# EAGLE design hubi2c-n32 (EAGLE 7.7.0)
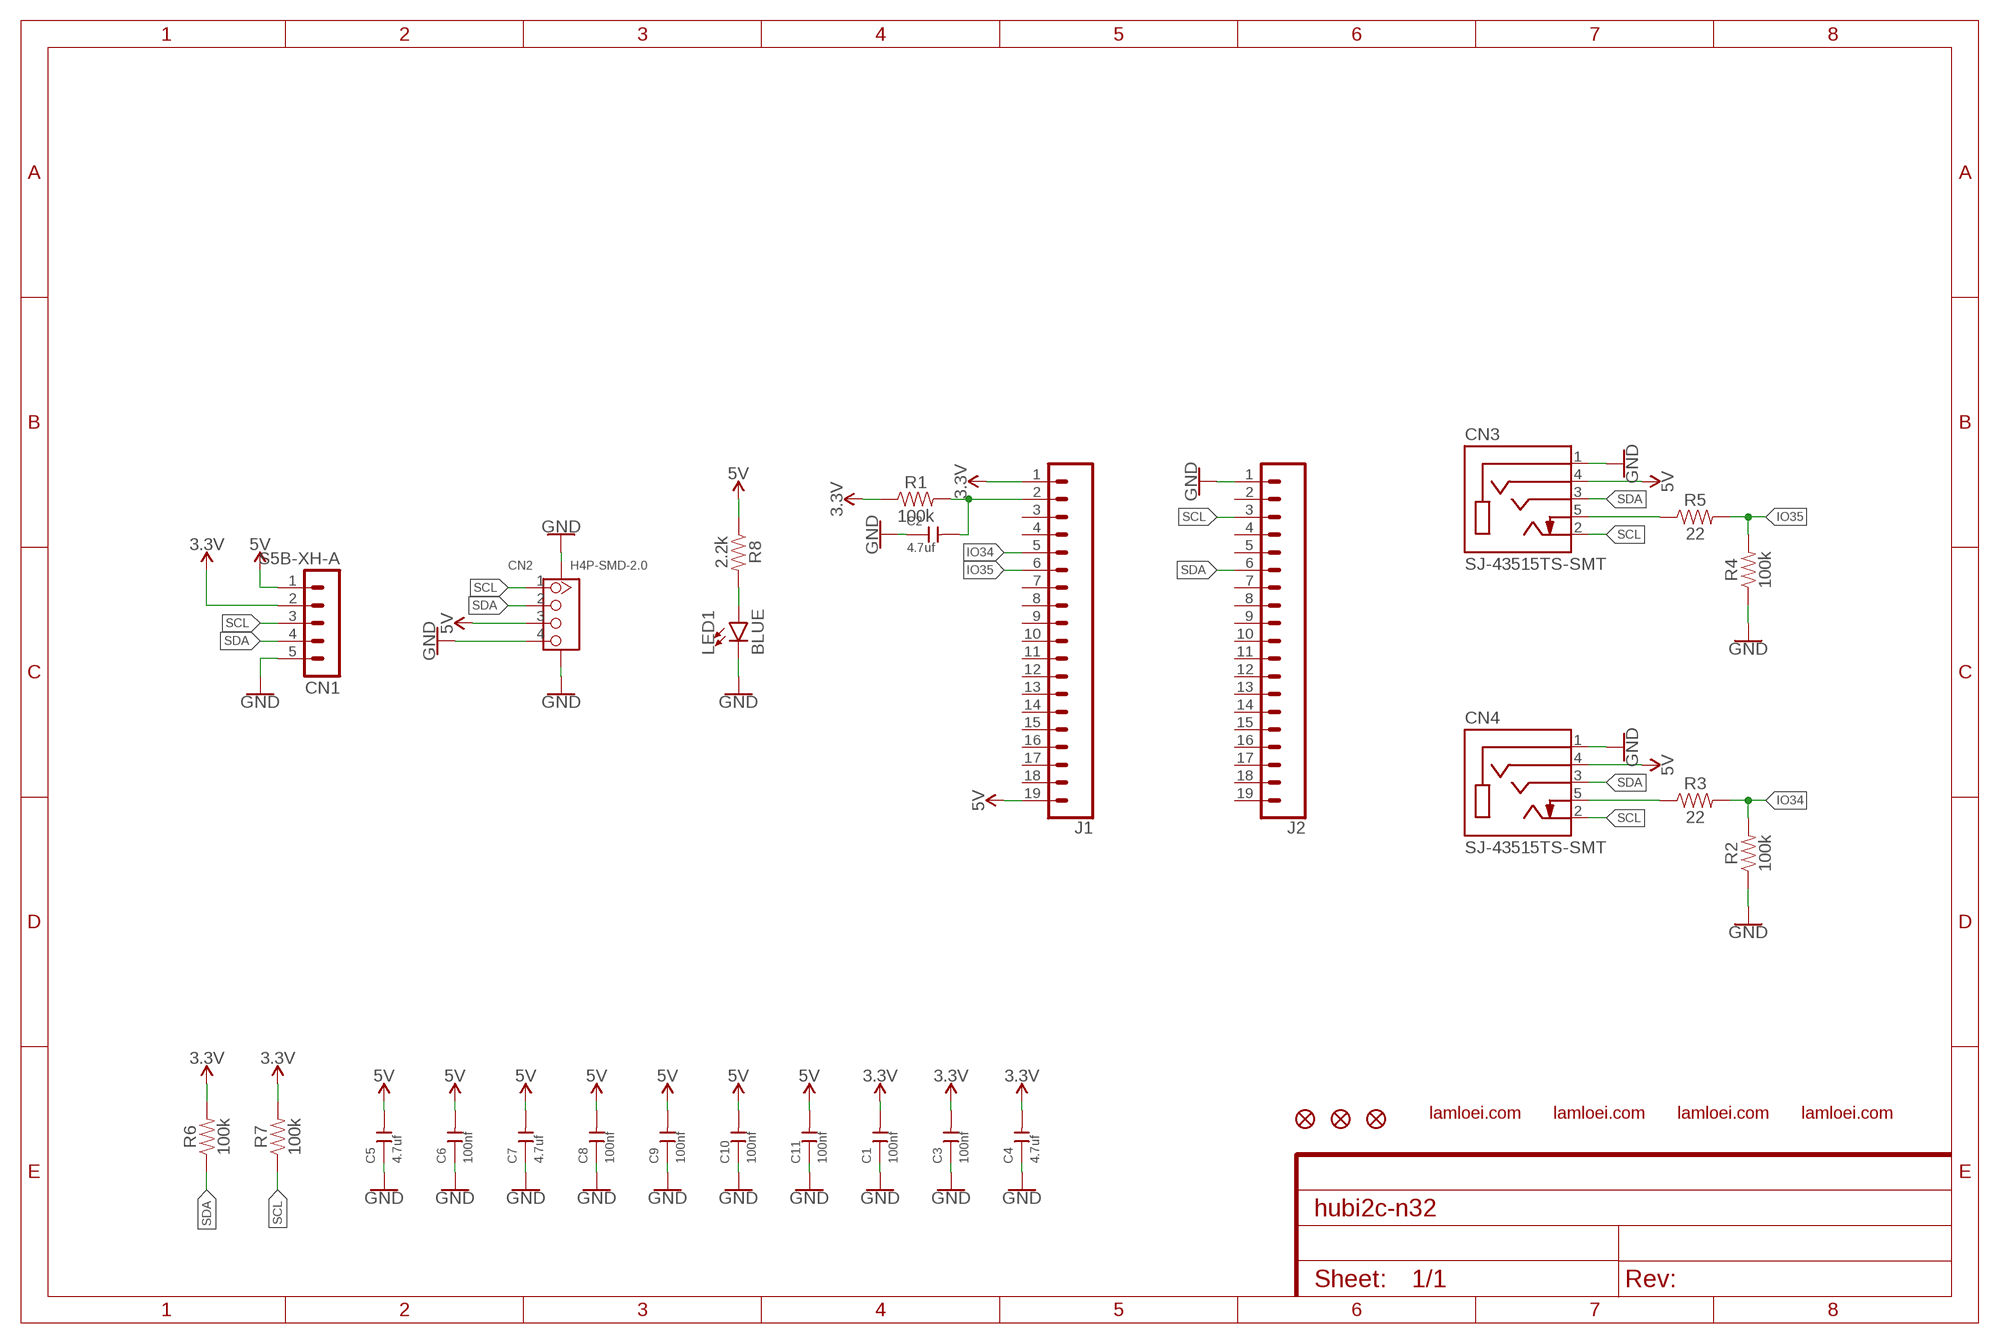
[diagram p0: schematic, sheet 1]

## Parts
C1  100nf  CERAMIC-100NF-25V-10%-X7R(0402)  [C0402]
C2  4.7uf  CERAMIC-4.7UF-10V-10%-X5R(0603)  [C0603]
C3  100nf  CERAMIC-100NF-25V-10%-X7R(0402)  [C0402]
C4  4.7uf  CERAMIC-4.7UF-10V-10%-X5R(0603)  [C0603]
C5  4.7uf  CERAMIC-4.7UF-10V-10%-X5R(0603)  [C0603]
C6  100nf  CERAMIC-100NF-25V-10%-X7R(0402)  [C0402]
C7  4.7uf  CERAMIC-4.7UF-10V-10%-X5R(0603)  [C0603]
C8  100nf  CERAMIC-100NF-25V-10%-X7R(0402)  [C0402]
C9  100nf  CERAMIC-100NF-25V-10%-X7R(0402)  [C0402]
C10  100nf  CERAMIC-100NF-25V-10%-X7R(0402)  [C0402]
C11  100nf  CERAMIC-100NF-25V-10%-X7R(0402)  [C0402]
CN1  S5B-XH-A  [S5B-XH-A]
CN2  H4P-SMD-2.0  GROVE-CONNECTOR-SMD(4+2P-2.0)  [HW4-SMD-2.0]
CN3  SJ-43515TS-SMT  [CUI_SJ-43515TS-SMT]
CN4  SJ-43515TS-SMT  [CUI_SJ-43515TS-SMT]
J1  CONN_19  [1X19]
J2  CONN_19  [1X19]
LED1  BLUE  LED-BLUE0603  [LED-0603]
R1  100k  100KOHM-0603-1/10W-1%  [0603]
R2  100k  100KOHM-0603-1/10W-1%  [0603]
R3  22  0OHM-0603-1/10W  [0603]
R4  100k  100KOHM-0603-1/10W-1%  [0603]
R5  22  0OHM-0603-1/10W  [0603]
R6  100k  100KOHM-0603-1/10W-1%  [0603]
R7  100k  100KOHM-0603-1/10W-1%  [0603]
R8  2.2k  2.2KOHM-0603-1/10W-1%  [0603]
ZFD1  FIDUCIAL1X2  [FIDUCIAL-1X2]
ZFD2  FIDUCIAL1X2  [FIDUCIAL-1X2]
ZFD3  FIDUCIAL1X2  [FIDUCIAL-1X2]
ZL1  LAMLEOI_LOGO_3  [LAMLEOI_LOGO_3]
ZL2  LAMLEOI_LOGO_3  [LAMLEOI_LOGO_3]
ZL3  LAMLEOI_LOGO_3  [LAMLEOI_LOGO_3]
ZL4  LAMLOEI_BIGLOGO  [LAMLOEI_BIGLOGO]

## Nets
3.3V: C1.2 C3.2 C4.2 CN1.2 J1.1 R1.1 R6.2 R7.2
5V: C5.2 C6.2 C7.2 C8.2 C9.2 C10.2 C11.2 CN1.1 CN2.3 CN3.4(RING2) CN4.4(RING2) J1.19 R8.1
GND: C1.1 C2.1 C3.1 C4.1 C5.1 C6.1 C7.1 C8.1 C9.1 C10.1 C11.1 CN1.5 CN2.4 CN2.SS1 CN2.SS2 CN3.1(SLEEVE) CN4.1(SLEEVE) J2.1 LED1.C R2.1 R4.1
IO34: J1.5 R2.2 R3.2
IO35: J1.6 R4.2 R5.2
N$1: CN4.5(TIP_SWITCH) R3.1
N$2: CN3.5(TIP_SWITCH) R5.1
N$3: C2.2 J1.2 R1.2
N$4: LED1.A R8.2
SCL: CN1.3 CN2.1 CN3.2(TIP) CN4.2(TIP) J2.3 R7.1
SDA: CN1.4 CN2.2 CN3.3(RING1) CN4.3(RING1) J2.6 R6.1
Unconnected: J1.3 J1.4 J1.7 J1.8 J1.9 J1.10 J1.11 J1.12 J1.13 J1.14 J1.15 J1.16 J1.17 J1.18 J2.2 J2.4 J2.5 J2.7 J2.8 J2.9 J2.10 J2.11 J2.12 J2.13 J2.14 J2.15 J2.16 J2.17 J2.18 J2.19

## Library data of the parts
C1 C3 C6 C8-C11 = Capacitor-2016:CERAMIC-100NF-25V-10%-X7R(0402): 302010024; MPN: CC0402KRX7R8BB104
C2 C4 C5 C7 = Capacitor-2016:CERAMIC-4.7UF-10V-10%-X5R(0603): 302010111; MPN: CC0603KRX5R6BB475
CN1 = con-JST XH:S5B-XH: JST XH series header 2.50mm pitch disconnectable crimp style connectors, horizontal (side entry type), 5 pins
CN2 = Seeed-OPL-Connector:GROVE-CONNECTOR-SMD(4+2P-2.0): 320110030
CN3 CN4 = SJ-43515TS-SMT:SJ-43515TS-SMT: 4 conductor 3.5 mm Surface Mount Audio Jack w/ Tip Switch; AVAILABILITY: Unavailable; CUI_PURCHASE_URL: https://www.cuidevices.com/product/interconnect/connectors/audio-connectors/jacks/sj-4351x-smt-series?utm_source=snapeda.com&utm_medium=referral&utm_campaign=snapedaBOM; DESCRIPTION: 3.5 mm, 4 Conductors, Right Angle, Surface Mount _SMT_, Audio Jack Connector; MF: CUI Devices; MP: SJ-43515TS-SMT-TR; PACKAGE: None; PRICE: None
J1 = SparkFun-Connectors-2:CONN_19: Multi connection point. Often used as Generic Header-pin footprint for 0.1 inch spaced/style header connections On any of the 0.1 inch spaced packages, you can populate with these: Break Away Headers - Straight <https://www.sparkfun.com/products/116> (PRT-00116) Break Away Male Headers - Right Angle <https://www.sparkfun.com/products/553> (PRT-00553) Female Headers <https://www.sparkfun.com/products/115> (PRT-00115) Break Away Headers - Machine Pin <https://www.sparkfun.com/products/117> (PRT-00117) Break Away Female Headers - Swiss Machine Pin <https://www.sparkfun.com/products/743> (PRT-00743) For SCREWTERMINALS and SPRING TERMINALS visit here: Screw Terimnals on SparkFun.com <https://www.sparkfun.com/search/results?term=Screw+Terminals> (5mm/3.5mm/2.54mm spacing) This device is also useful as a general connection point to wire up your design to another part of your project. Our various solder wires solder well into these plated through hole pads. Hook-Up Wire - Assortment (Stranded, 22 AWG) <https://www.sparkfun.com/products/11375> (PRT-11375) Hook-Up Wire - Assortment (Solid Core, 22 AWG) <https://www.sparkfun.com/products/11367> (PRT-11367) View the entire wire category on our website here <https://www.sparkfun.com/categories/141> Special notes: Molex polarized connector foot print use with SKU : PRT-08231 with associated crimp pins and housings. 1MM SMD Version SKU: PRT-10208 NOTES ON THE VARIANTS LOCK and LOCK_LONGPADS... This footprint was designed to help hold the alignment of a through-hole component (i.e. 6-pin header) while soldering it into place. You may notice that each hole has been shifted either up or down by 0.005 of an inch from it's more standard position (which is a perfectly straight line). This slight alteration caused the pins (the squares in the middle) to touch the edges of the holes. Because they are alternating, it causes a "brace" to hold the component in place. 0.005 has proven to be the perfect amount of "off-center" position when using our standard breakaway headers. Although looks a little odd when you look at the bare footprint, once you have a header in there, the alteration is very hard to notice. Also,if you push a header all the way into place, it is covered up entirely on the bottom side.
J2 = SparkFun-Connectors-3:CONN_19: Multi connection point. Often used as Generic Header-pin footprint for 0.1 inch spaced/style header connections On any of the 0.1 inch spaced packages, you can populate with these: Break Away Headers - Straight <https://www.sparkfun.com/products/116> (PRT-00116) Break Away Male Headers - Right Angle <https://www.sparkfun.com/products/553> (PRT-00553) Female Headers <https://www.sparkfun.com/products/115> (PRT-00115) Break Away Headers - Machine Pin <https://www.sparkfun.com/products/117> (PRT-00117) Break Away Female Headers - Swiss Machine Pin <https://www.sparkfun.com/products/743> (PRT-00743) For SCREWTERMINALS and SPRING TERMINALS visit here: Screw Terimnals on SparkFun.com <https://www.sparkfun.com/search/results?term=Screw+Terminals> (5mm/3.5mm/2.54mm spacing) This device is also useful as a general connection point to wire up your design to another part of your project. Our various solder wires solder well into these plated through hole pads. Hook-Up Wire - Assortment (Stranded, 22 AWG) <https://www.sparkfun.com/products/11375> (PRT-11375) Hook-Up Wire - Assortment (Solid Core, 22 AWG) <https://www.sparkfun.com/products/11367> (PRT-11367) View the entire wire category on our website here <https://www.sparkfun.com/categories/141> Special notes: Molex polarized connector foot print use with SKU : PRT-08231 with associated crimp pins and housings. 1MM SMD Version SKU: PRT-10208 NOTES ON THE VARIANTS LOCK and LOCK_LONGPADS... This footprint was designed to help hold the alignment of a through-hole component (i.e. 6-pin header) while soldering it into place. You may notice that each hole has been shifted either up or down by 0.005 of an inch from it's more standard position (which is a perfectly straight line). This slight alteration caused the pins (the squares in the middle) to touch the edges of the holes. Because they are alternating, it causes a "brace" to hold the component in place. 0.005 has proven to be the perfect amount of "off-center" position when using our standard breakaway headers. Although looks a little odd when you look at the bare footprint, once you have a header in there, the alteration is very hard to notice. Also,if you push a header all the way into place, it is covered up entirely on the bottom side.
LED1 = SparkFun-LED:LED-BLUE: Blue SMD LED Used in manufacturing of various products at SparkFun Packages: 0603 - SMD 0603 package [Product Link] <http://www.digikey.com/product-detail/en/SMLE12BC7TT86/511-1589-2-ND/1641808> 1206 - SMD1206 package [Product Link] <http://www.digikey.com/product-detail/en/lite-on-inc/LTST-C150TBKT/160-1643-1-ND/573584> SparkFun Products: ESP8266 Thing-Dev Board <https://www.sparkfun.com/products/13711> RedBoard <https://www.sparkfun.com/products/12757>; PROD_ID: DIO-08575
R1 R2 R4 R6 R7 = SparkFun-Resistors:100KOHM: 100kΩ resistor A resistor is a passive two-terminal electrical component that implements electrical resistance as a circuit element. Resistors act to reduce current flow, and, at the same time, act to lower voltage levels within circuits. - Wikipedia; PROD_ID: RES-07828
R3 R5 = SparkFun-Resistors:0OHM: 0Ω resistor A resistor is a passive two-terminal electrical component that implements electrical resistance as a circuit element. Resistors act to reduce current flow, and, at the same time, act to lower voltage levels within circuits. - Wikipedia; PROD_ID: RES-08609; VALUE: 0
R8 = SparkFun-Resistors:2.2KOHM: 2.2kΩ resistor A resistor is a passive two-terminal electrical component that implements electrical resistance as a circuit element. Resistors act to reduce current flow, and, at the same time, act to lower voltage levels within circuits. - Wikipedia; PROD_ID: RES-08272
ZFD1-ZFD3 = SparkFun-Aesthetics:FIDUCIAL: Fiducial Alignment Points Point-of-reference for pick-and-place machines and other optical instruments.
ZL1-ZL3 = lamloei_logo_3:LAMLEOI_LOGO_3: lamloei
ZL4 = lamloei_logo_3:LAMLOEI_BIGLOGO

## Board
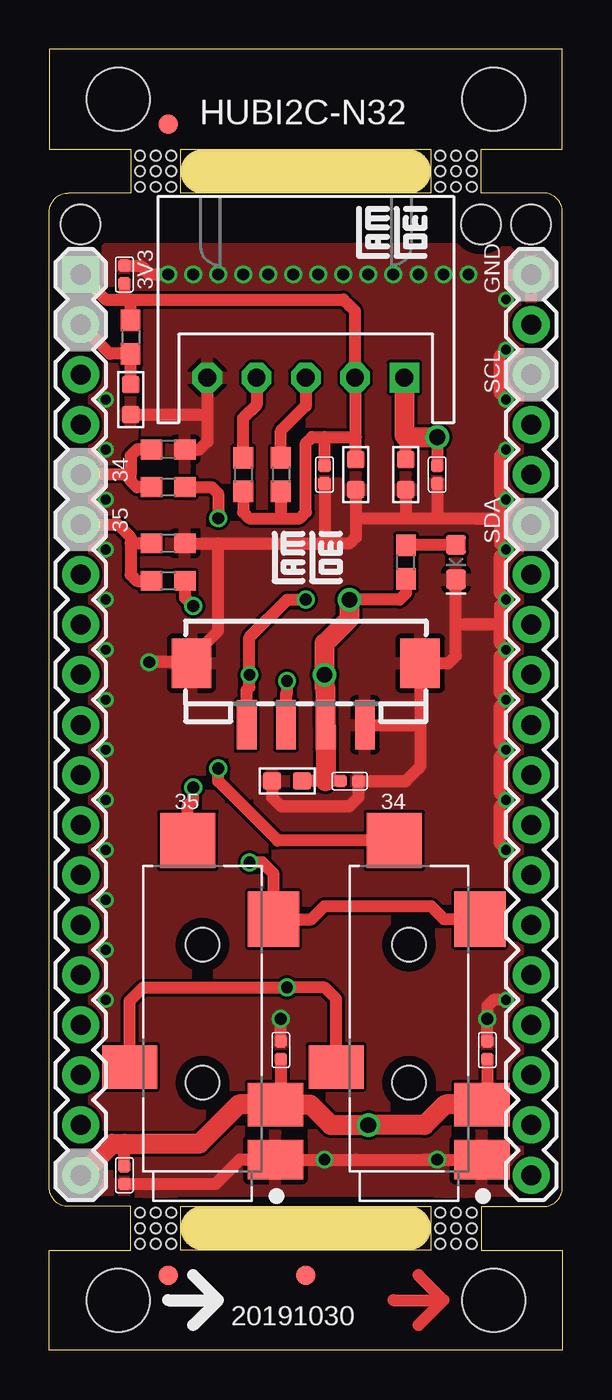
[diagram p1: board, top side]
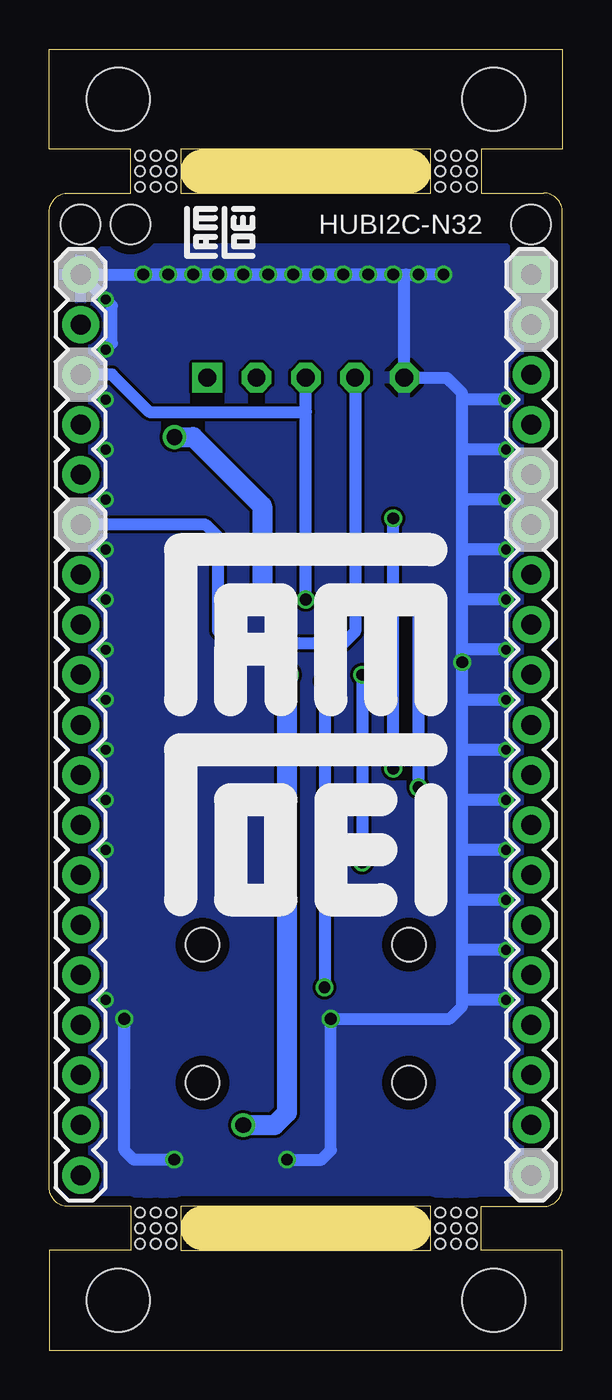
[diagram p2: board, bottom side, seen from below]

Size 26.04 x 66.04 mm. Coordinates in mm from the lower left corner, seen from the top.
Outline: 6.67,7.3 19.37,7.3 19.37,5.08 6.67,5.08 6.67,7.3
Outline: 23.81,58.74 21.91,58.74 21.91,60.96 26.04,60.96 26.04,66.04 0,66.04 0,60.96 4.13,60.96 4.13,58.74 2.22,58.74 0.95,58.74 arc90 0,57.78 0,8.26 arc90 0.95,7.3 4.13,7.3 4.13,5.08 0,5.08 0,0 26.04,0 26.04,5.08 21.91,5.08 21.91,7.3 25.08,7.3 arc90 26.04,8.26 26.04,57.78 arc90 25.08,58.74 23.81,58.74
Outline: 19.37,58.74 6.67,58.74 6.67,60.96 19.37,60.96 19.37,58.74
Copper layers (1*16): Top 0.035mm / dielectric 1.6mm / Bottom 0.035mm
Design rules "Elecrow_2-layer_PCB_eagle_rule-32": minimum track width 6mil, minimum drill 12mil, track to track 6mil, track to pad 6mil, pad to pad 6mil, via to via 8mil, smd to smd 0mil, copper to edge 20mil, drill to drill 10mil, minimum pad ring 6mil, minimum via ring 6mil, stop-mask expansion 0mil, vias tented up to drill 32mil, thermal gap 10mil
Holes 2 mm at 1.59,57.15 24.45,57.15 21.91,57.15
Holes 0.5 mm at 5.4,6.99 20.64,6.99 20.64,59.05 5.4,59.05 6.19,59.05 4.6,59.05 21.43,59.05 19.84,59.05 6.19,6.99 4.6,6.99 21.43,6.99 19.84,6.99 6.19,59.85 6.19,60.64 5.4,59.85 5.4,60.64 4.6,60.64 4.6,59.85 19.84,59.85 20.64,59.85 21.43,59.85 21.43,60.64 20.64,60.64 19.84,60.64 4.6,6.19 4.6,5.4 5.4,6.19 5.4,5.4 6.19,6.19 6.19,5.4 19.84,6.19 19.84,5.4 20.64,6.19 21.43,6.19 21.43,5.4 20.64,5.4
Holes 3.2 mm at 3.49,63.5 22.54,63.5 3.49,2.54 22.54,2.54
Milling: 2 lines

### Footprints (pad centres in the part's own frame; a part is rotated, then mirrored left to right if it is on the bottom)
C0402 = smd 0.635 x 0.635: 1 0,0.445; 2 0,-0.445
C0603 = smd 0.889 x 0.889: 1 0,0.762; 2 0,-0.762
S5B-XH-A = drill 0.9 pad 1.5 square: 1 5,0 | drill 0.9 pad 1.5 octagon: 2 2.5,0; 3 0,0; 4 -2.5,0; 5 -5,0
HW4-SMD-2.0 = smd 1 x 2.5: 1 -3,0; 2 -1,0; 3 1,0; 4 3,0 | smd 2 x 2.5: SS1 -5.8,3.123; SS2 5.8,3.123
CUI_SJ-43515TS-SMT = smd 2 x 2.8: 1 -7.15,-3.7 | smd 2.8 x 2.6: 2 5.05,-3.6 | smd 2.2 x 2.8: 3 -2.45,3.7; 4 -4.35,-3.7 | smd 2.8 x 2.8: 5 9.05,0.75 | hole 1.7: -3.25,0; 3.75,0
1X19 = drill 1.016 pad 1.88 square: 1 0,0 | drill 1.016 pad 1.88: 2 2.54,0; 3 5.08,0; 4 7.62,0; 5 10.16,0; 6 12.7,0; 7 15.24,0; 8 17.78,0; 9 20.32,0; 10 22.86,0; 11 25.4,0; 12 27.94,0; 13 30.48,0; 14 33.02,0; 15 35.56,0; 16 38.1,0; 17 40.64,0; 18 43.18,0; 19 45.72,0
1X19' = drill 1.016 pad 1.88: 1 0,0; 2 2.54,0; 3 5.08,0; 4 7.62,0; 5 10.16,0; 6 12.7,0; 7 15.24,0; 8 17.78,0; 9 20.32,0; 10 22.86,0; 11 25.4,0; 12 27.94,0; 13 30.48,0; 14 33.02,0; 15 35.56,0; 16 38.1,0; 17 40.64,0; 18 43.18,0; 19 45.72,0
LED-0603 = smd 1 x 1: A -0.877,0; C 0.877,0
0603 = smd 1.1 x 1: 1 -0.85,0; 2 0.85,0
FIDUCIAL-1X2 = smd 1 x 1: 1 0,0

### Placement (x,y rotation side)
C1  3.81,54.61 0 top
C2  4.13,48.26 180 top
C3  13.97,44.45 180 top
C4  15.56,44.45 180 top
C5  18.1,44.45 180 top
C6  19.68,44.45 180 top
C7  12.06,28.89 90 top
C8  15.24,28.89 270 top
C9  11.75,15.24 0 top
C10  22.22,15.24 0 top
C11  3.81,8.89 180 top
CN1  13.02,49.37 0 top
CN2  13.02,31.75 0 top
CN3  7.78,16.83 90 top
CN4  18.26,16.83 90 top
J1  1.59,54.61 270 top
J2  [1X19']  24.45,54.61 270 top
LED1  20.64,40.01 270 top
R1  4.13,51.44 270 top
R2  6.03,45.72 180 top
R3  6.03,43.81 180 top
R4  6.03,40.96 180 top
R5  6.03,39.05 180 top
R6  9.84,44.45 270 top
R7  11.75,44.45 270 top
R8  18.1,40.01 90 top
ZFD1  6.03,62.23 0 top
ZFD2  6.03,3.81 0 top
ZFD3  13.02,3.81 0 top
ZL1  15.4,55.24 0 top
ZL2  19.37,55.24 0 bottom
ZL3  11.11,38.73 0 top
ZL4  19.37,40.64 270 bottom

### Tracks (layer width: path | path; a pad name or v marks a point on that pad's centre or on a via)
3.3V
  Top 0.61: R6.2 9.84,42.55 10.16,42.23 11.75,42.23 | 11.75,42.23 12.7,42.23 13.02,42.55 13.02,46.04 13.33,46.35 13.97,46.35 | 13.97,46.35 15.56,46.35 | C4.2 15.56,46.35 | 15.56,46.35 15.52,46.4 CN1.2 15.52,52.74 15.24,53.02 14.92,53.34 4.13,53.34 | C3.2 13.97,46.35 | R7.2 11.75,42.23 | R1.1 4.13,53.34 | J1.1 2.86,53.34 3.81,53.34 | 3.81,53.34 4.13,53.34 | C1.2 3.81,53.34
5V  (via drill 0.8)
  Top 0.61: C9.2 11.75,12.75 CN3.4 | C10.2 22.22,12.75 CN4.4 | C7.2 14.02,28.89 C8.2 | v19.68,46.35 C6.2 | C5.2 18.1,46.35 | R8.1 18.1,38.42 17.78,38.1 v15.24,38.1 | C11.2 3.81,10.48
  Top 1.016: 14.02,28.89 CN2.3 14.02,33.61 13.97,33.66 v13.97,34.29 13.97,35.88 15.24,37.15 v15.24,38.1 | CN1.1 18.02,46.44 18.1,46.35 v19.68,46.35 | J1.19 3.18,10.48 3.81,10.48 4.76,10.48 7.62,10.48 9.62,12.48 CN3.4 13.24,12.48 14.29,11.43 v16.19,11.43 19.05,11.43 20.1,12.48 CN4.4
  Bottom 1.016: v19.68,46.35 18.73,46.35 15.24,42.86 v15.24,38.1 | v16.19,11.43 14.6,11.43 13.97,12.06 v13.97,34.29
GND  (via drill 0.5, 0.6)
  Top 0.61: v13.97,9.68 CN3.1 9.68,9.68 9.21,9.21 8.45,8.45 C11.1 | v13.97,9.68 15.56,9.68 | 15.56,9.68 19.05,9.68 | 19.05,9.68 v19.68,9.68 | v19.68,9.68 CN4.1 | 18.82,31.75 CN2.SS2 20.27,34.87 20.64,35.24 20.64,36.83 | 18.82,31.75 18.82,29.61 18.73,29.53 18.1,28.89 C8.1 15.68,28.07 15.56,27.94 15.24,27.62 11.75,27.62 11.3,28.07 C7.1 | CN2.4 18.82,31.75 | R4.1 7.94,40.96 8.57,40.96 | 8.57,40.96 13.97,40.96 | C3.1 13.97,40.96 | v6.03,54.61 5.08,54.61 4.64,55.05 C1.1 | R2.1 7.62,45.72 7.94,46.04 8.02,46.12 8.02,47.62 | CN1.5 8.02,47.62 | v13.97,9.68 15.56,9.68 | C9.1 v11.75,16.83 | v19.68,9.68 19.05,9.68 | C10.1 v22.22,16.83 22.22,17.46 22.54,17.78 v23.18,17.78 | 8.57,40.96 8.57,36.51 7.22,35.16 7.22,34.92 | CN2.SS1 7.22,34.92 | 7.22,34.92 v5.08,34.92 | 19.37,42.23 18.73,42.23 | 18.73,42.23 18.1,42.23 | 18.1,42.23 15.56,42.23 | 15.56,42.23 15.56,41.27 15.24,40.96 13.97,40.96 | C4.1 15.56,42.23 | C5.1 18.1,42.23 | 20.64,36.83 LED1.C | 19.68,42.23 21.59,42.23 22.86,42.23 | 19.68,42.23 18.73,42.23 | C6.1 19.68,42.23 | v23.18,48.26 22.86,48.58 22.86,50.48 v23.18,50.8 | 22.86,42.23 22.86,42.86 v23.18,43.18 22.86,43.5 22.86,45.4 v23.18,45.72 | 22.86,42.23 22.86,40.96 v23.18,40.64 22.86,40.32 22.86,38.42 v23.18,38.1 22.86,37.78 22.86,36.83 | 22.86,36.83 22.86,35.88 v23.18,35.56 22.86,35.24 22.86,33.34 v23.18,33.02 22.86,32.7 22.86,30.8 v23.18,30.48 22.86,30.16 22.86,28.26 v23.18,27.94 22.86,27.62 22.86,25.72 v23.18,25.4 | 22.86,36.83 20.64,36.83 | C2.1 8.02,47.5 8.02,47.62
  Bottom 0.61: v21.27,54.61 J2.1 v23.18,53.34 22.86,53.02 22.86,51.12 v23.18,50.8 | v21.27,54.61 v20,54.61 | v20,54.61 v18.73,54.61 | v18.73,54.61 v17.46,54.61 | v17.46,54.61 v16.19,54.61 | v16.19,54.61 v14.92,54.61 | v14.92,54.61 v13.65,54.61 | v13.65,54.61 v12.38,54.61 | v12.38,54.61 v11.11,54.61 | v11.11,54.61 v9.84,54.61 | v9.84,54.61 v8.57,54.61 | v8.57,54.61 7.94,54.61 | 7.94,54.61 v7.3,54.61 v6.03,54.61 | 7.94,54.61 8.02,54.53 CN1.5 5.87,49.37 5.72,49.21 5.08,48.58 5.08,48.26 | 22.22,13.34 v22.22,16.83 22.22,10.16 21.74,9.68 v19.68,9.68 | 5.08,17.78 5.08,17.46 5.72,16.83 v11.75,16.83 11.75,10.16 12.23,9.68 v13.97,9.68 | 5.08,17.78 5.08,20.32 | 5.08,20.32 5.08,22.86 | 5.08,22.86 5.08,25.4 | 5.08,25.4 5.08,27.94 | 5.08,27.94 5.08,30.48 | 5.08,30.48 5.08,33.02 | 5.08,33.02 v5.08,34.92 | v5.08,34.92 5.08,35.56 | 5.08,35.56 5.08,36.2 | 5.08,36.2 5.08,38.1 | 5.08,38.1 5.08,40.32 | 5.08,40.32 5.08,42.86 | 5.08,42.86 5.08,45.72 | 5.08,45.72 5.08,48.26 | v5.08,34.92 5.08,35.56 | 5.08,35.56 5.08,36.2 | v8.57,54.61 7.94,54.61 | v8.57,54.61 v9.84,54.61 | v9.84,54.61 v11.11,54.61 | v11.11,54.61 v12.38,54.61 | v12.38,54.61 v13.65,54.61 | v13.65,54.61 v14.92,54.61 | v14.92,54.61 v16.19,54.61 | v16.19,54.61 v17.46,54.61 | v17.46,54.61 v18.73,54.61 | v18.73,54.61 v20,54.61 | v20,54.61 v21.27,54.61 | v2.86,48.26 5.08,48.26 | v2.86,45.72 5.08,45.72 | v2.86,43.18 5.08,43.18 5.08,42.86 | v2.86,40.64 5.08,40.64 5.08,40.32 | v2.86,38.1 5.08,38.1 | v2.86,35.56 5.08,35.56 | v2.86,33.02 5.08,33.02 | v2.86,30.48 5.08,30.48 | v2.86,27.94 5.08,27.94 | v2.86,25.4 5.08,25.4 | v2.86,22.86 5.08,22.86 | v2.86,20.32 5.08,20.32 | v2.86,17.78 5.08,17.78
  pour Top: 0,7.3 26.04,7.3 26.04,55.88 0,55.88
  pour Bottom: 0,7.3 26.04,7.3 26.04,55.88 0,55.88
IO34
  Top 0.61: R3.2 4.44,43.81 4.13,44.13 4.13,44.45 | 4.13,44.45 J1.5 | R2.2 4.44,45.72 4.13,45.4 4.13,44.45
IO35
  Top 0.61: 4.13,40.96 4.13,41.27 3.49,41.91 J1.6 | 4.13,40.96 4.13,39.37 4.44,39.05 R5.2 | R4.2 4.13,40.96
N$1  (via drill 0.6)
  Top 0.61: R3.1 8.25,43.81 8.57,43.5 v8.57,42.23 | CN4.5 11.59,25.88 8.57,28.89 v8.57,29.53
  Bottom 0.61: v8.57,29.53 8.57,41.91 v8.57,42.23
N$2  (via drill 0.6)
  Top 0.61: R5.1 6.88,38.2 v7.3,37.78 | 7.3,28.26 v7.3,28.57 7.3,27.94 7.03,27.67 CN3.5
  Bottom 0.61: v7.3,37.78 v7.3,28.57
N$3
  Top 0.61: J1.2 3.07,50.59 R1.2 C2.2
N$4
  Top 0.61: LED1.A 18.12,40.88 R8.2
N$31
  Top 0.61: 17.46,2.54 20,2.54 | 20,2.54 18.73,3.81 | 18.73,1.27 20,2.54
SCL  (via drill 0.6)
  Top 0.61: CN4.2 20.03,21.88 19.37,22.54 13.97,22.54 13.31,21.88 CN3.2 11.38,24.18 10.8,24.77 v10.16,24.77 | R7.1 11.75,46.67 13.02,47.94 CN1.3 | CN2.1 10.02,33.51 10.16,33.66 v10.16,34.29 10.16,36.2 12.07,38.1 v13.02,38.1
  Bottom 0.61: J2.3 22.86,49.53 20.95,47.62 13.02,47.62 | v10.16,34.29 10.16,27.3 10.16,25.72 | 10.16,25.72 v10.16,24.77 10.16,25.72 | v13.02,38.1 13.02,47.62 | 13.02,47.62 CN1.3
SDA  (via drill 0.6)
  Top 0.61: R6.1 9.84,47.31 10.52,47.98 CN1.4 | CN3.3 4.08,17.73 4.76,18.41 v12.07,18.41 13.97,18.41 14.56,17.83 CN4.3 | CN2.2 12.02,33.29 12.07,33.34 v12.07,33.97
  Bottom 0.61: v12.07,18.41 v12.07,33.97 12.07,35.88 | CN1.4 10.52,36.47 11.11,35.88 12.07,35.88 | 12.07,35.88 14.92,35.88 16.83,35.88 17.46,36.51 17.46,41.27 18.1,41.91 J2.6

### Text on the board
tPlace: HUBI2C-N32 | 3V3 | GND | SCL | 34 | 35 | SDA | 35 | 34 | 20191030
bPlace: HUBI2C-N32
tDocu: 01 | 3V3 | C1 | 100n | GND | 02 | 03 | EN | R1 | 04 | 05 | 100K | C2 | SCL | 06 | 07 | CN1 | 4u7 | R2 | 100K | 08 | 09 | R6 | R7 | C3 | C4 | C5 | C6 | R3 | 22 | 100n | 100n | 10 | 11 | 100K | 100K | 4u7 | 4u7 | R4 | 100K | R8 | LED1 | SDA | 12 | 13 | R5 | 22 | 2K2 | BLU | 14 | 15 | 16 | 17 | 18 | 19 | CN2 | 20 | 21 | C7 | 4u7 | C8 | 100n | 22 | 23 | 24 | 25 | 26 | 27 | 28 | 29 | 30 | 31 | CN3 | CN4 | C9 | C10 | 32 | 33 | 100n | 100n | 34 | 35 | 36 | 37 | 5V | C11 | 100n | 38